# EAGLE design vRef+Therm_Mod_v2 (EAGLE 8.1.0)
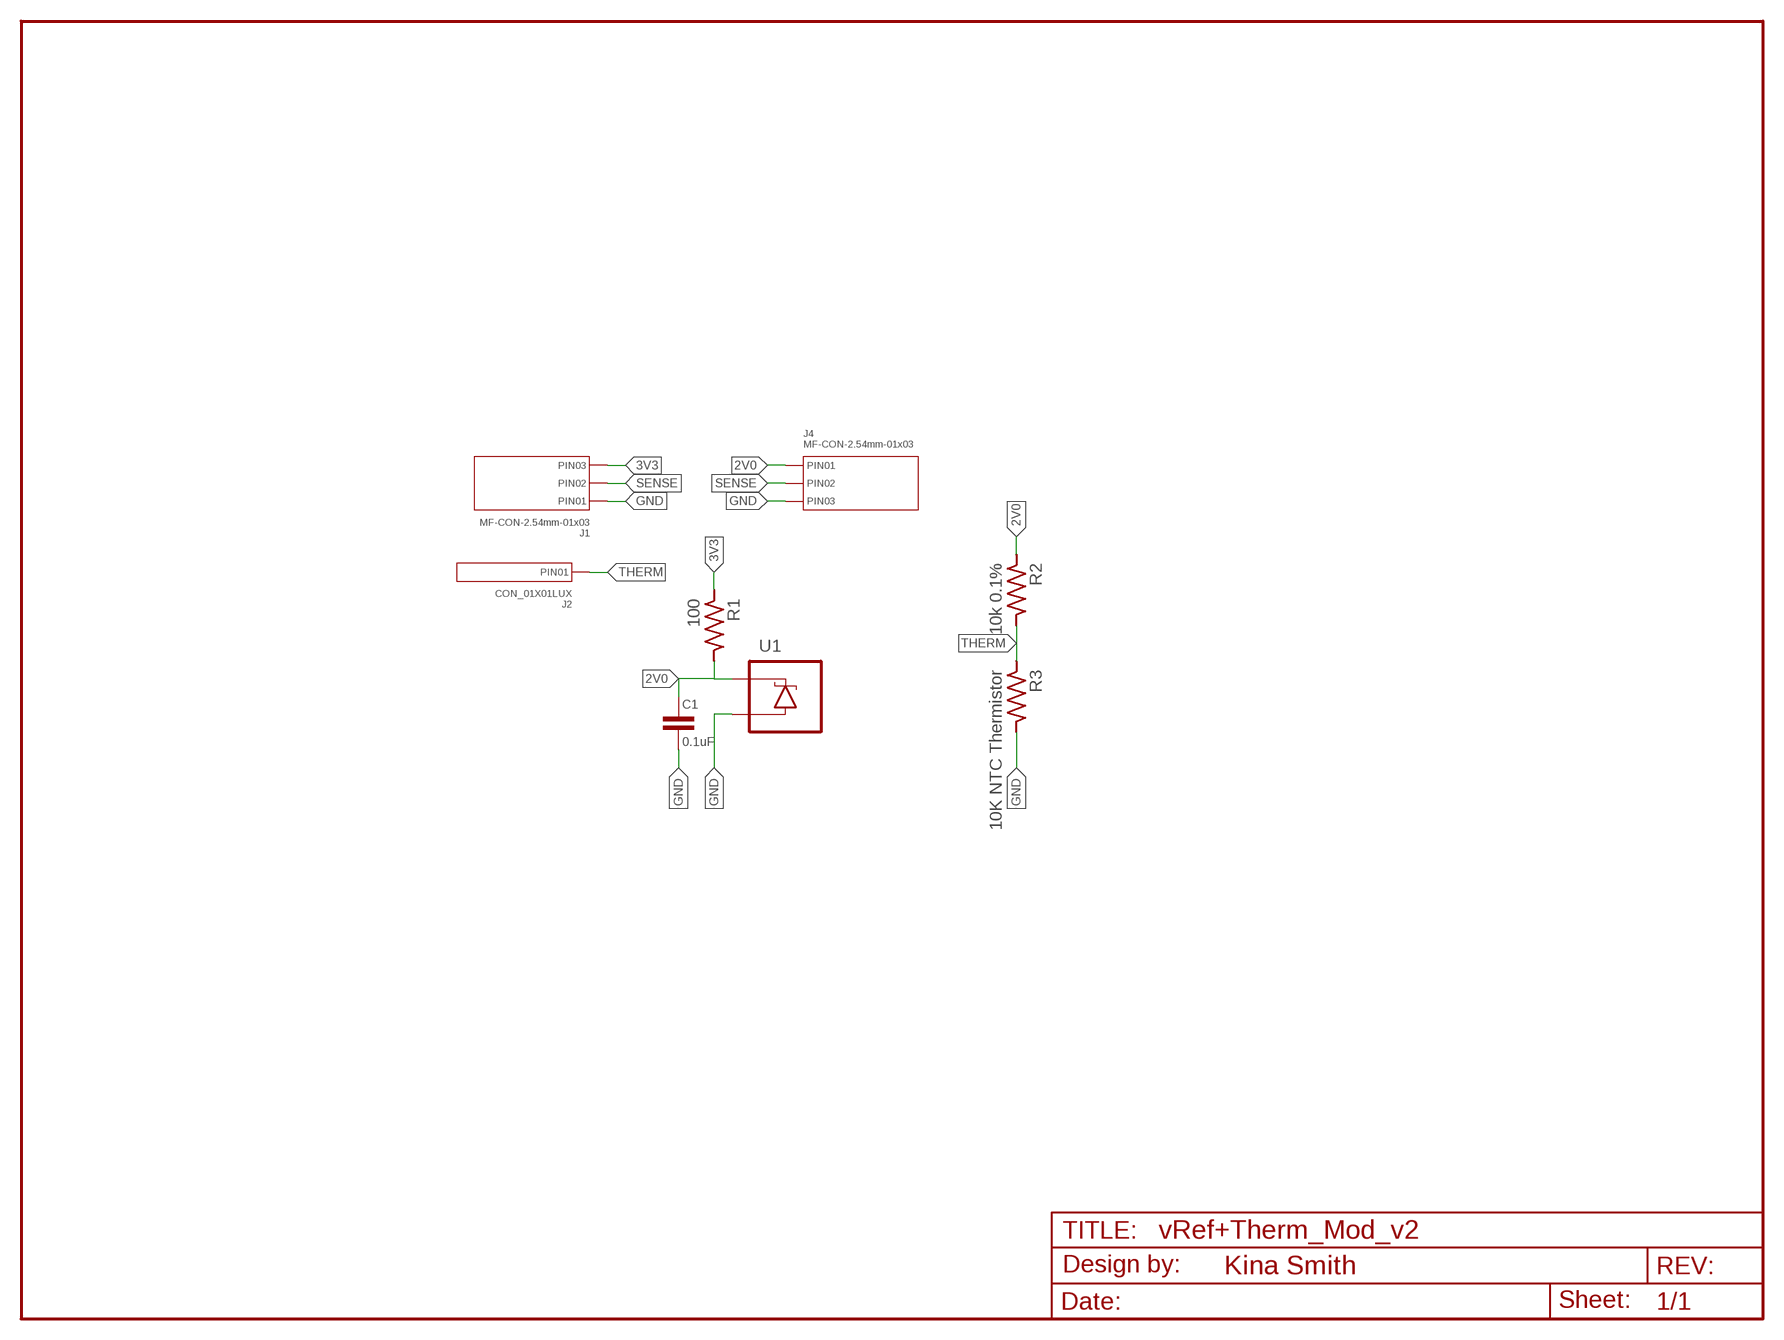
[diagram p0: schematic, sheet 1]

## Parts
C1  0.1uF  CAPACITOR_NP0603-N  [C0603-N]
FRAME1  FRAME-LETTERNO_PACKAGE  [DUMMY]
J1  MF-CON-2.54mm-01x03  CON_01X03_PTH_2.54MM  [PTH_2.54MM_01X03]
J2  CON_01X01LUX  [1X01_LUXEON-PAD]
J4  MF-CON-2.54mm-01x03  CON_01X03_PTH_2.54MM  [PTH_2.54MM_01X03]
R1  100  RESISTOR0603-N  [R0603-N]
R2  10k 0.1%  RESISTOR0603-N  [R0603-N]
R3  10K NTC Thermistor  RESISTOR0603-N  [R0603-N]
U1  LM4040-SOT-23-3  [SOT23-3]

## Nets
2V0: C1.1 J4.P$1(PIN1) R1.2 R2.1 U1.1(C)
3V3: J1.P$3(PIN3) R1.1
GND: C1.2 J1.P$1(PIN1) J4.P$3(PIN3) R3.2 U1.2(A)
SENSE: J1.P$2(PIN2) J4.P$2(PIN2)
THERM: J2.P$1(PIN1) R2.2 R3.1

## Library data of the parts
C1 = My_Passives:CAPACITOR_NP
FRAME1 = My_Aesthetics:FRAME-LETTER: Schematic Frame Standard 8.5x11 US Letter frame; DESIGNER: Nobody; PARTNO: NA; VERSION: v01
J1 J4 = My_Connectors:CON_01X03: Library: MF_Connectors Description: Header Connector with 03 Positions and 01 Rows. Use the LABEL Attribute to label the pin on the schematic and PCB. You can remove the attributes on the PCB by using the SMASH function on the part and then deleting the text.; HOUSEPART: YES; MPN: MF-CON-2.54mm-01x03; POPULATE: 1; URL: https://factory.macrofab.com/part/MF-CON-2.54mm-01x03
J2 = My_Connectors:CON_01X01: Library: MF_Connectors Description: Header Connector with 01 Positions and 01 Rows. Use the LABEL Attribute to label the pin on the schematic and PCB. You can remove the attributes on the PCB by using the SMASH function on the part and then deleting the text.
R1-R3 = My_Passives:RESISTOR
U1 = My_Descrete_Semiconductors:LM4040; PARTNO: LM4040AIM3-2.0/NOPB

## Board
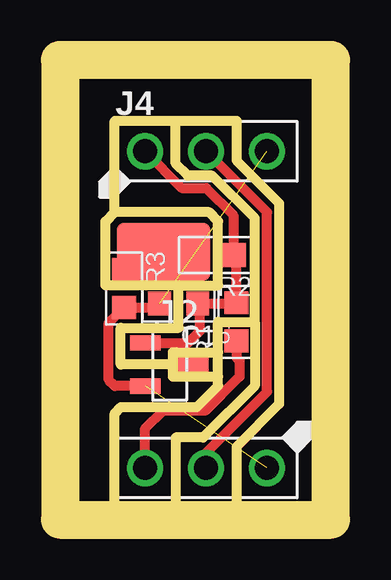
[diagram p1: board, top side]

Size 11.3 x 19.18 mm. Coordinates in mm from the lower left corner, seen from the top.
Outline: 0,0 11.3,0 11.3,19.18 0,19.18 0,0
Copper layers (1*16): Top 0.035mm / dielectric 1.5mm / Bottom 0.035mm
Design rules "default": minimum track width 10mil, minimum drill 0.6mm, track to track 8mil, track to pad 8mil, pad to pad 8mil, via to via 8mil, smd to smd 8mil, copper to edge 40mil, drill to drill 8mil, minimum pad ring 10mil, minimum via ring 8mil, stop-mask expansion 4mil, vias tented up to drill 0mil, thermal gap 10mil
Milling: 38 lines

### Footprints (pad centres in the part's own frame; a part is rotated, then mirrored left to right if it is on the bottom)
C0603-N = smd 0.95 x 1: 1 -0.8,0; 2 0.8,0
PTH_2.54MM_01X03 = drill 1: P$1 -2.54,0; P$2 0,0; P$3 2.54,0
1X01_LUXEON-PAD = smd 3.9 x 2.4: P$1 0,0
R0603-N = smd 0.95 x 1: 1 -0.8,0; 2 0.8,0
SOT23-3 = smd 0.635 x 1.27: 1 -0.9,-1; 2 0.9,-1; 3 0,1

### Placement (x,y rotation side)
C1  4.95,9.02 180 top
FRAME1  7.37,19.94 0 top
J1  6.1,2.16 180 top
J2  4.32,11.18 180 top
J4  6.1,15.37 0 top
R1  7.37,8.25 90 top
R2  6.48,11.05 180 top
R3  2.67,9.65 270 top
U1  4.57,6.48 270 top

### Tracks (layer width: path | path; a pad name or v marks a point on that pad's centre or on a via)
2V0
  Top 0.406: J4.P$1 5.08,13.84 6.1,13.84 7.24,12.7 7.24,11.09 R2.1 7.37,10.96 R1.2 7.33,9.02 C1.1 5.84,8.93 5.84,7.87 5.34,7.38 U1.1
3V3
  Top 0.406: J1.P$3 3.56,3.81 4.32,4.57 6.1,4.57 7.49,5.97 7.49,6.63 7.37,6.76 R1.1
GND  (2 unrouted)
  Top 0.406: C1.2 3.99,8.85 R3.2 2.03,8.22 2.03,5.84 2.3,5.58 U1.2
SENSE
  Top 0.406: J1.P$2 6.1,2.79 8.64,5.33 8.64,12.83 J4.P$2
THERM
  Top 0.406: R3.1 3.39,11.18 J2.P$1 5.55,11.18 R2.2